# Altium schematic sheet SOM.SchDoc: SOM Main Schematic
size A4; Author: A. Kalberer; CompanyName: NTB; Organization: NTB Interstate University of Applied; Address1: Werdenbergstrasse 4; Address3: 9471 Buchs; Address4: Switzerland; Organization1: Sciences of Technology Buchs; Size: A4
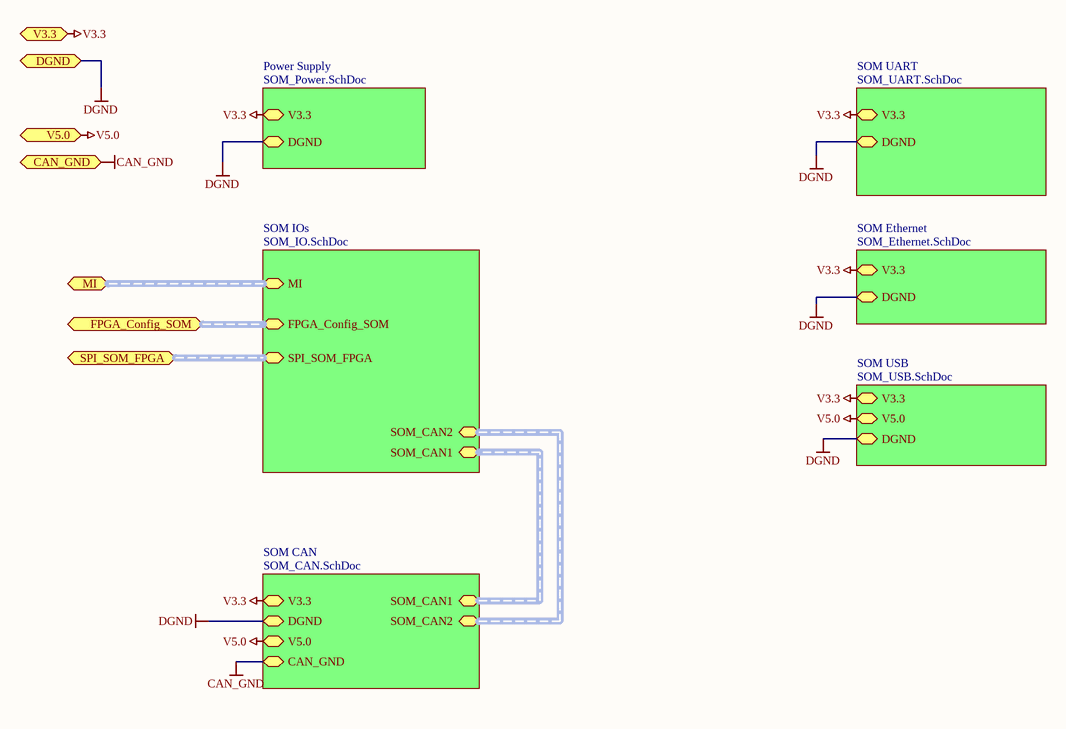
[diagram p0: SOM.SchDoc]

## Sub-sheets
Power Supply = SOM_Power.SchDoc: V3.3, DGND
SOM CAN = SOM_CAN.SchDoc: V3.3, DGND, V5.0, CAN_GND, SOM_CAN1 (harness SOM_CAN1), SOM_CAN2 (harness SOM_CAN2)
SOM Ethernet = SOM_Ethernet.SchDoc: DGND, V3.3
SOM IOs = SOM_IO.SchDoc: MI (harness MI), FPGA_Config_SOM (harness FPGA_Config_SOM), SPI_SOM_FPGA (harness SPI_SOM_FPGA), SOM_CAN1 (harness SOM_CAN1), SOM_CAN2 (harness SOM_CAN2)
SOM UART = SOM_UART.SchDoc: V3.3, DGND
SOM USB = SOM_USB.SchDoc: V3.3, V5.0, DGND

## Ports
CAN_GND, DGND, FPGA_Config_SOM (harness FPGA_Config_SOM), MI (harness MI), SPI_SOM_FPGA (harness SPI_SOM_FPGA), V3.3, V5.0

## Nets
CAN_GND: port CAN_GND, sheet SOM CAN/CAN_GND
DGND: port DGND, sheet Power Supply/DGND, sheet SOM UART/DGND, sheet SOM Ethernet/DGND, sheet SOM CAN/DGND, sheet SOM USB/DGND
V3.3: port V3.3, sheet Power Supply/V3.3, sheet SOM UART/V3.3, sheet SOM Ethernet/V3.3, sheet SOM CAN/V3.3, sheet SOM USB/V3.3
V5.0: port V5.0, sheet SOM CAN/V5.0, sheet SOM USB/V5.0

## Buses and harness runs
harness port FPGA_Config_SOM = sheet SOM IOs/FPGA_Config_SOM
harness port MI = sheet SOM IOs/MI
harness port SPI_SOM_FPGA = sheet SOM IOs/SPI_SOM_FPGA
harness sheet SOM CAN/SOM_CAN1 = sheet SOM IOs/SOM_CAN1
harness sheet SOM CAN/SOM_CAN2 = sheet SOM IOs/SOM_CAN2

## Notes on the sheet
- Title:
- Description:
- Size:
- Date:
- Name:
- Number:
- Time:
- Revision:
- Sheet
- Checked:
- of
- File: